# Altium schematic sheet Core Controller V4.0.SchDoc
size 406 x 381 mm
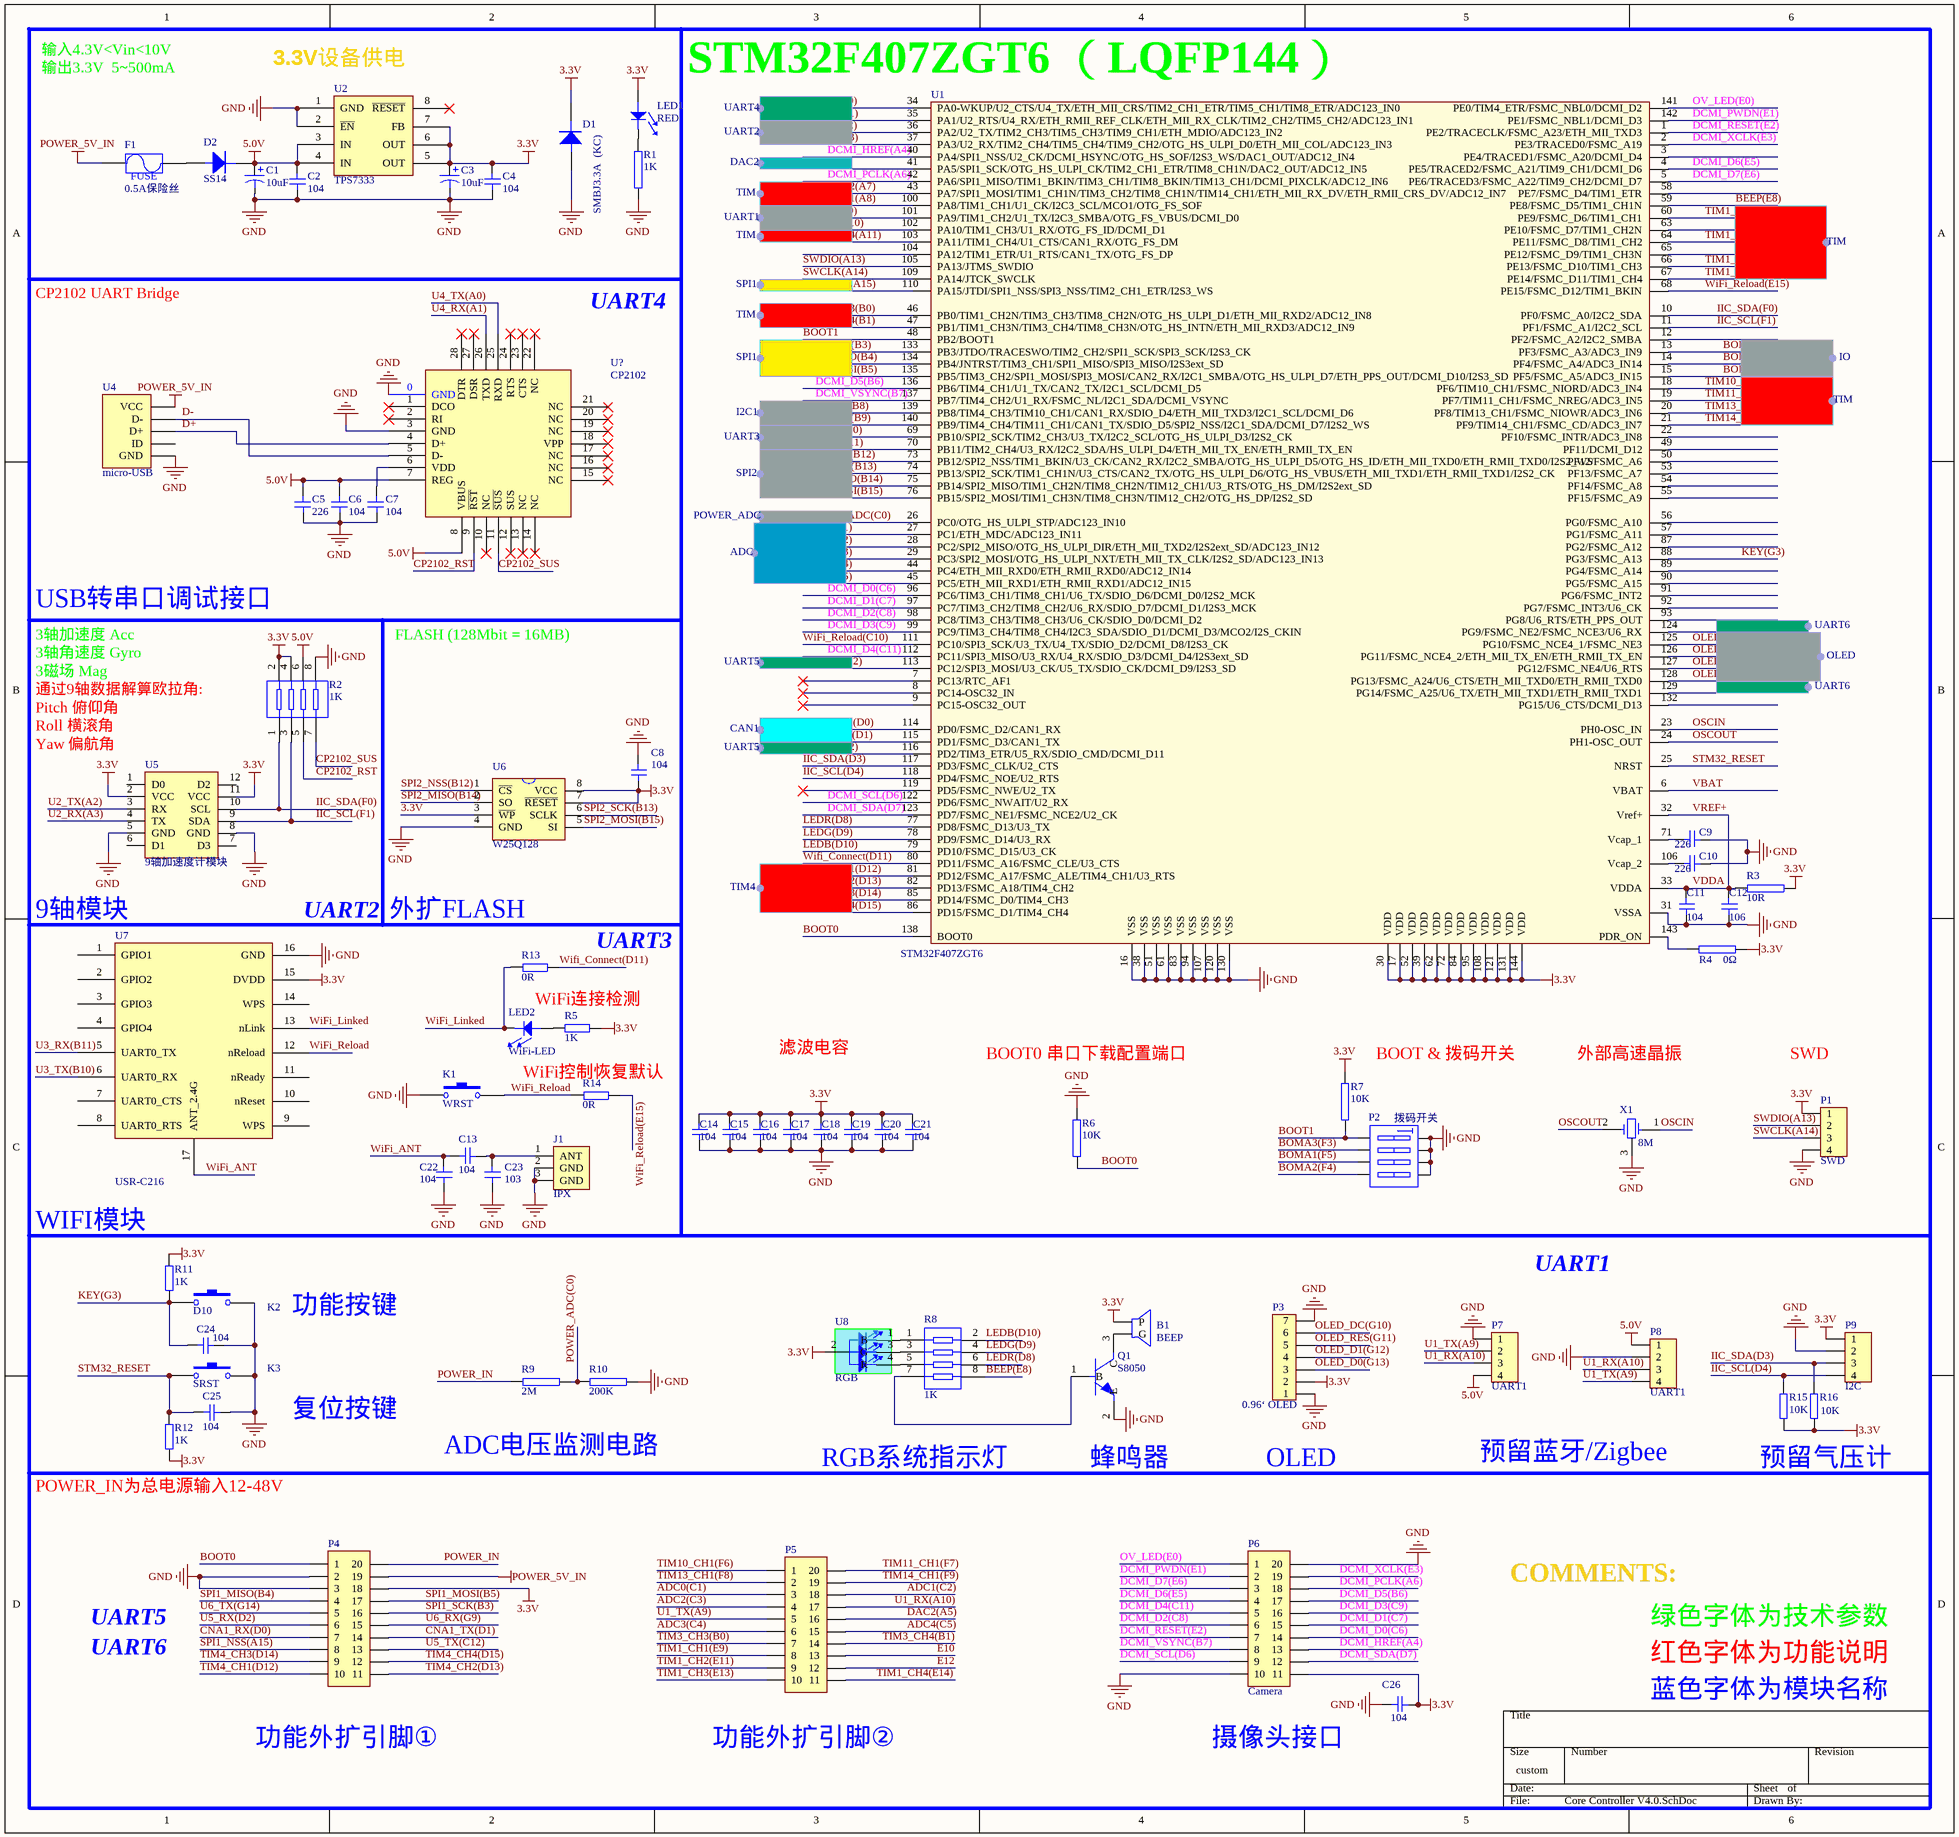
[diagram p0: Core Controller V4.0.SchDoc]

## Parts
B1  BEEP  [BUZZER]
C1  10uF  [TAJ-A]
C2  104  [0805C]
C3  10uF  [TAJ-A]
C4  104  [0805C]
C5  226  [0805C]
C6  104  [0805C]
C7  104  [0805C]
C8  104  [0805C]
C9  226  [0805C]
C10  226  [0805C]
C11  104  [0805C]
C12  106  [0805C]
C13  104  [0805C]
C14  104  [0805C]
C15  104  [0805C]
C16  104  [0805C]
C17  104  [0805C]
C18  104  [0805C]
C19  104  [0805C]
C20  104  [0805C]
C21  104  [0805C]
C22  104  [0805C]
C23  103  [0805C]
C24  104  [0805C]
C25  104  [0805C]
C26  104  [0805C]
D1  SMBJ3.3A  (KC)  [SMBJ]
D2  SS14  [SMA/DO-214AC]
F1  0.5A保险丝  [1206R]
J1  IPX  [IPX天线底座]
K1  WRST  [贴片按键]
K2  D10  [贴片按键]
K3  SRST  [贴片按键]
LED1  RED  [0805LED(RED)]
LED2  WiFi-LED  [0805LED(GREEN)]
P1  SWD  [Header 4]
P2  拨码开关  [拨码开关(4位贴片)]
P3  0.96‘ OLED  [Header 7]
P4  (no value)  [Header 10X2]
P5  (no value)  [Header 10X2]
P6  Camera  [Header 10X2]
P7  UART1  [Header 4(排母)]
P8  UART1  [Header 4(排母)]
P9  I2C  [Header 4(排母)]
Q1  S8050  [SOT-23]
R1  1K  [0805R]
R2  1K  [排阻(4位贴片)]
R3  10R  [0805R]
R4  0Ω  [0805R]
R5  1K  [0805R]
R6  10K  [0805R]
R7  10K  [0805R]
R8  1K  [排阻(4位贴片)]
R9  2M  [0805R]
R10  200K  [0805R]
R11  1K  [0805R]
R12  1K  [0805R]
R13  0R  [0805R]
R14  0R  [0805R]
R15  10K  [0805R]
R16  10K  [0805R]
U1  STM32F407ZGT6  [LQFP-144]
U2  TPS7333  [SOP-8]
U4  micro-USB  [Micro-USB (兼容牛角)]
U5  9轴加速度计模块  [9轴加速度计]
U6  W25Q128  [SOW-8]
U7  USR-C216  [USR-C216]
U8  RGB  [RGB-3528]
U?  CP2102  [QFN-28]
X1  8M  [三脚贴片8M晶振]

## Harnesses
SPI1: 
SPI2: 
ADC: 
UART4: 
UART2: 
UART3: 
CAN1: 
TIM: 
TIM4: 
DAC2: 
UART5: 
UART1: 
POWER_ADC: 
I2C1: 
UART6: 
OLED: 
IO: 

## Nets
3.3V: B1.1(P) C3.1 C4.2 C8.1 C14.2 C15.2 C16.2 C17.2 C18.2 C19.2 C20.2 C21.2 C26.1 D1.2 LED1.1 P1.1 P3.2 P4.18 P6.11 P9.1 R2.2 R2.4 R3.2 R4.2 R5.1 R7.2 R11.2 R12.1 R15.1 R16.1 U1.17(VDD) U1.30(VDD) U1.39(VDD) U1.52(VDD) U1.62(VDD) U1.72(VDD) U1.84(VDD) U1.95(VDD) U1.108(VDD) U1.121(VDD) U1.131(VDD) U1.144(VDD) U2.5(OUT) U2.6(OUT) U2.7(FB) U5.2(VCC) U5.11(VCC) U6.3(~{WP}) U6.7(~{RESET}) U6.8(VCC) U7.15(DVDD) U8.2
5.0V: C1.1 C2.2 C5.1 C6.1 D2.2 P7.4 P8.1 R2.6 U2.3(IN) U2.4(IN) U?.7(REG) U?.8(VBUS)
GND: C1.2 C2.1 C3.2 C4.1 C5.2 C6.2 C7.2 C8.2 C9.1 C10.1 C11.1 C12.1 C14.1 C15.1 C16.1 C17.1 C18.1 C19.1 C20.1 C21.1 C22.1 C23.1 C24.2 C25.2 C26.2 D1.1 J1.2(GND) J1.3(GND) K1.1 K2.2 K3.2 P1.4 P2.5(B4) P2.6(B3) P2.7(B2) P2.8(B1) P3.1 P3.7 P4.2 P4.3 P6.10 P6.20 P7.1 P8.2 P9.2 Q1.2(E) R1.1 R2.8 R6.2 R10.2 U1.16(VSS) U1.31(VSSA) U1.38(VSS) U1.51(VSS) U1.61(VSS) U1.83(VSS) U1.94(VSS) U1.107(VSS) U1.120(VSS) U1.130(VSS) U2.1(GND) U2.2(~{EN}) U4.5(GND) U5.5(GND) U5.8(GND) U6.4(GND) U7.16(GND) U?.0(GND) U?.3(GND) X1.3
POWER_5V_IN: F1.1 P4.19 U4.1(VCC)
ADC0(C1): P5.3 U1.27(PC1/ETH_MDC/ADC123_IN11)
ADC1(C2): P5.18 U1.28(PC2/SPI2_MISO/OTG_HS_ULPI_DIR/ETH_MII_TXD2/I2S2ext_SD/ADC123_IN12)
ADC2(C3): P5.4 U1.29(PC3/SPI2_MOSI/OTG_HS_ULPI_NXT/ETH_MII_TX_CLK/I2S2_SD/ADC123_IN13)
ADC3(C4): P5.6 U1.44(PC4/ETH_MII_RXD0/ETH_RMII_RXD0/ADC12_IN14)
ADC4(C5): P5.15 U1.45(PC5/ETH_MII_RXD1/ETH_RMII_RXD1/ADC12_IN15)
BEEP(E8): R8.8 U1.59(PE8/FSMC_D5/TIM1_CH1N)
BOMA1(F5): P2.3(A3) U1.15(PF5/FSMC_A5/ADC3_IN15)
BOMA2(F4): P2.4(A4) U1.14(PF4/FSMC_A4/ADC3_IN14)
BOMA3(F3): P2.2(A2) U1.13(PF3/FSMC_A3/ADC3_IN9)
BOOT0: P4.1 R6.1 U1.138(BOOT0)
BOOT1: P2.1(A1) R7.1 U1.48(PB2/BOOT1)
CNA1_RX(D0): P4.7 U1.114(PD0/FSMC_D2/CAN1_RX)
CNA1_TX(D1): P4.14 U1.115(PD1/FSMC_D3/CAN1_TX)
CP2102_RST: R2.5 U?.9(~{RST})
CP2102_SUS: R2.7 U?.11(~{SUS})
D+: U4.3(D+) U?.4(D+)
D-: U4.2(D-) U?.5(D-)
DAC2(A5): P5.16 U1.41(PA5/SPI1_SCK/OTG_HS_ULPI_CK/TIM2_CH1_ETR/TIM8_CH1N/DAC2_OUT/ADC12_IN5)
DCMI_D0(C6): P6.14 U1.96(PC6/TIM3_CH1/TIM8_CH1/U6_TX/SDIO_D6/DCMI_D0/I2S2_MCK)
DCMI_D1(C7): P6.15 U1.97(PC7/TIM3_CH2/TIM8_CH2/U6_RX/SDIO_D7/DCMI_D1/I2S3_MCK)
DCMI_D2(C8): P6.6 U1.98(PC8/TIM3_CH3/TIM8_CH3/U6_CK/SDIO_D0/DCMI_D2)
DCMI_D3(C9): P6.16 U1.99(PC9/TIM3_CH4/TIM8_CH4/I2C3_SDA/SDIO_D1/DCMI_D3/MCO2/I2S_CKIN)
DCMI_D4(C11): P6.5 U1.112(PC11/SPI3_MISO/U3_RX/U4_RX/SDIO_D3/DCMI_D4/I2S3ext_SD)
DCMI_D5(B6): P6.17 U1.136(PB6/TIM4_CH1/U1_TX/CAN2_TX/I2C1_SCL/DCMI_D5)
DCMI_D6(E5): P6.4 U1.4(PE5/TRACED2/FSMC_A21/TIM9_CH1/DCMI_D6)
DCMI_D7(E6): P6.3 U1.5(PE6/TRACED3/FSMC_A22/TIM9_CH2/DCMI_D7)
DCMI_HREF(A4): P6.13 U1.40(PA4/SPI1_NSS/U2_CK/DCMI_HSYNC/OTG_HS_SOF/I2S3_WS/DAC1_OUT/ADC12_IN4)
DCMI_PCLK(A6): P6.18 U1.42(PA6/SPI1_MISO/TIM1_BKIN/TIM3_CH1/TIM8_BKIN/TIM13_CH1/DCMI_PIXCLK/ADC12_IN6)
DCMI_PWDN(E1): P6.2 U1.142(PE1/FSMC_NBL1/DCMI_D3)
DCMI_RESET(E2): P6.7 U1.1(PE2/TRACECLK/FSMC_A23/ETH_MII_TXD3)
DCMI_SCL(D6): P6.9 U1.122(PD6/FSMC_NWAIT/U2_RX)
DCMI_SDA(D7): P6.12 U1.123(PD7/FSMC_NE1/FSMC_NCE2/U2_CK)
DCMI_VSYNC(B7): P6.8 U1.137(PB7/TIM4_CH2/U1_RX/FSMC_NL/I2C1_SDA/DCMI_VSYNC)
DCMI_XCLK(E3): P6.19 U1.2(PE3/TRACED0/FSMC_A19)
E10: P5.13 U1.63(PE10/FSMC_D7/TIM1_CH2N)
E12: P5.12 U1.65(PE12/FSMC_D9/TIM1_CH3N)
IIC1_SCL(B8): U1.139(PB8/TIM4_CH3/TIM10_CH1/CAN1_RX/SDIO_D4/ETH_MII_TXD3/I2C1_SCL/DCMI_D6)
IIC1_SDA(B9): U1.140(PB9/TIM4_CH4/TIM11_CH1/CAN1_TX/SDIO_D5/SPI2_NSS/I2C1_SDA/DCMI_D7/I2S2_WS)
IIC_SCL(D4): P9.4 R15.2 U1.118(PD4/FSMC_NOE/U2_RTS)
IIC_SCL(F1): R2.3 U1.11(PF1/FSMC_A1/I2C2_SCL) U5.9(SDA)
IIC_SDA(D3): P9.3 R16.2 U1.117(PD3/FSMC_CLK/U2_CTS)
IIC_SDA(F0): R2.1 U1.10(PF0/FSMC_A0/I2C2_SDA) U5.10(SCL)
KEY(G3): C24.1 K2.1 R11.1 U1.88(PG3/FSMC_A13)
LEDB(D10): R8.2 U1.79(PD10/FSMC_D15/U3_CK)
LEDG(D9): R8.4 U1.78(PD9/FSMC_D14/U3_RX)
LEDR(D8): R8.6 U1.77(PD8/FSMC_D13/U3_TX)
OLED_D0(G13): P3.3 U1.128(PG13/FSMC_A24/U6_CTS/ETH_MII_TXD0/ETH_RMII_TXD0)
OLED_D1(G12): P3.4 U1.127(PG12/FSMC_NE4/U6_RTS)
OLED_DC(G10): P3.6 U1.125(PG10/FSMC_NCE4_1/FSMC_NE3)
OLED_RES(G11): P3.5 U1.126(PG11/FSMC_NCE4_2/ETH_MII_TX_EN/ETH_RMII_TX_EN)
OSCIN: U1.23(PH0-OSC_IN) X1.1
OSCOUT: U1.24(PH1-OSC_OUT) X1.2
OV_LED(E0): P6.1 U1.141(PE0/TIM4_ETR/FSMC_NBL0/DCMI_D2)
POWER_ADC(C0): R9.2 R10.1 U1.26(PC0/OTG_HS_ULPI_STP/ADC123_IN10)
POWER_IN: P4.20 R9.1
SPI1_MISO(B4): P4.4 U1.134(PB4/JNTRST/TIM3_CH1/SPI1_MISO/SPI3_MISO/I2S3ext_SD)
SPI1_MOSI(B5): P4.17 U1.135(PB5/TIM3_CH2/SPI1_MOSI/SPI3_MOSI/CAN2_RX/I2C1_SMBA/OTG_HS_ULPI_D7/ETH_PPS_OUT/DCMI_D10/I2S3_SD)
SPI1_NSS(A15): P4.8 U1.110(PA15/JTDI/SPI1_NSS/SPI3_NSS/TIM2_CH1_ETR/I2S3_WS)
SPI1_SCK(B3): P4.16 U1.133(PB3/JTDO/TRACESWO/TIM2_CH2/SPI1_SCK/SPI3_SCK/I2S3_CK)
SPI2_MISO(B14): U1.75(PB14/SPI2_MISO/TIM1_CH2N/TIM8_CH2N/TIM12_CH1/U3_RTS/OTG_HS_DM/I2S2ext_SD) U6.2(SO)
SPI2_MOSI(B15): U1.76(PB15/SPI2_MOSI/TIM1_CH3N/TIM8_CH3N/TIM12_CH2/OTG_HS_DP/I2S2_SD) U6.5(SI)
SPI2_NSS(B12): U1.73(PB12/SPI2_NSS/TIM1_BKIN/U3_CK/CAN2_RX/I2C2_SMBA/OTG_HS_ULPI_D5/OTG_HS_ID/ETH_MII_TXD0/ETH_RMII_TXD0/I2S2_WS) U6.1(~{CS})
SPI2_SCK(B13): U1.74(PB13/SPI2_SCK/TIM1_CH1N/U3_CTS/CAN2_TX/OTG_HS_ULPI_D6/OTG_HS_VBUS/ETH_MII_TXD1/ETH_RMII_TXD1/I2S2_CK) U6.6(SCLK)
STM32_RESET: C25.1 K3.1 R12.2 U1.25(NRST)
SWCLK(A14): P1.3 U1.109(PA14/JTCK_SWCLK)
SWDIO(A13): P1.2 U1.105(PA13/JTMS_SWDIO)
TIM1_CH1(A8): U1.100(PA8/TIM1_CH1/U1_CK/I2C3_SCL/MCO1/OTG_FS_SOF)
TIM1_CH1(E9): P5.8 U1.60(PE9/FSMC_D6/TIM1_CH1)
TIM1_CH2(E11): P5.9 U1.64(PE11/FSMC_D8/TIM1_CH2)
TIM1_CH3(E13): P5.10 U1.66(PE13/FSMC_D10/TIM1_CH3)
TIM1_CH4(A11): U1.103(PA11/TIM1_CH4/U1_CTS/CAN1_RX/OTG_FS_DM)
TIM1_CH4(E14): P5.11 U1.67(PE14/FSMC_D11/TIM1_CH4)
TIM3_CH2(A7): U1.43(PA7/SPI1_MOSI/TIM1_CH1N/TIM3_CH2/TIM8_CH1N/TIM14_CH1/ETH_MII_RX_DV/ETH_RMII_CRS_DV/ADC12_IN7)
TIM3_CH3(B0): P5.7 U1.46(PB0/TIM1_CH2N/TIM3_CH3/TIM8_CH2N/OTG_HS_ULPI_D1/ETH_MII_RXD2/ADC12_IN8)
TIM3_CH4(B1): P5.14 U1.47(PB1/TIM1_CH3N/TIM3_CH4/TIM8_CH3N/OTG_HS_INTN/ETH_MII_RXD3/ADC12_IN9)
TIM4_CH1(D12): P4.10 U1.81(PD12/FSMC_A17/FSMC_ALE/TIM4_CH1/U3_RTS)
TIM4_CH2(D13): P4.11 U1.82(PD13/FSMC_A18/TIM4_CH2)
TIM4_CH3(D14): P4.9 U1.85(PD14/FSMC_D0/TIM4_CH3)
TIM4_CH4(D15): P4.12 U1.86(PD15/FSMC_D1/TIM4_CH4)
TIM10_CH1(F6): P5.1 U1.18(PF6/TIM10_CH1/FSMC_NIORD/ADC3_IN4)
TIM11_CH1(F7): P5.20 U1.19(PF7/TIM11_CH1/FSMC_NREG/ADC3_IN5)
TIM13_CH1(F8): P5.2 U1.20(PF8/TIM13_CH1/FSMC_NIOWR/ADC3_IN6)
TIM14_CH1(F9): P5.19 U1.21(PF9/TIM14_CH1/FSMC_CD/ADC3_IN7)
U1_RX(A10): P5.17 P7.3 P8.3 U1.102(PA10/TIM1_CH3/U1_RX/OTG_FS_ID/DCMI_D1)
U1_TX(A9): P5.5 P7.2 P8.4 U1.101(PA9/TIM1_CH2/U1_TX/I2C3_SMBA/OTG_FS_VBUS/DCMI_D0)
U2_RX(A3): U1.37(PA3/U2_RX/TIM2_CH4/TIM5_CH4/TIM9_CH2/OTG_HS_ULPI_D0/ETH_MII_COL/ADC123_IN3) U5.4(TX)
U2_TX(A2): U1.36(PA2/U2_TX/TIM2_CH3/TIM5_CH3/TIM9_CH1/ETH_MDIO/ADC123_IN2) U5.3(RX)
U3_RX(B11): U1.70(PB11/TIM2_CH4/U3_RX/I2C2_SDA/HS_ULPI_D4/ETH_MII_TX_EN/ETH_RMII_TX_EN) U7.5(UART0_TX)
U3_TX(B10): U1.69(PB10/SPI2_SCK/TIM2_CH3/U3_TX/I2C2_SCL/OTG_HS_ULPI_D3/I2S2_CK) U7.6(UART0_RX)
U4_RX(A1): U1.35(PA1/U2_RTS/U4_RX/ETH_RMII_REF_CLK/ETH_MII_RX_CLK/TIM2_CH2/TIM5_CH2/ADC123_IN1) U?.26(TXD)
U4_TX(A0): U1.34(PA0-WKUP/U2_CTS/U4_TX/ETH_MII_CRS/TIM2_CH1_ETR/TIM5_CH1/TIM8_ETR/ADC123_IN0) U?.25(RXD)
U5_RX(D2): P4.6 U1.116(PD2/TIM3_ETR/U5_RX/SDIO_CMD/DCMI_D11)
U5_TX(C12): P4.13 U1.113(PC12/SPI3_MOSI/U3_CK/U5_TX/SDIO_CK/DCMI_D9/I2S3_SD)
U6_RX(G9): P4.15 U1.124(PG9/FSMC_NE2/FSMC_NCE3/U6_RX)
U6_TX(G14): P4.5 U1.129(PG14/FSMC_A25/U6_TX/ETH_MII_TXD1/ETH_RMII_TXD1)
VBAT: U1.6(VBAT)
VDDA: C11.2 C12.2 R3.1 U1.32(Vref+) U1.33(VDDA)  [also labelled VREF+]
WiFi_ANT: C13.2 C22.2 U7.17(ANT_2.4G)
Wifi_Connect(D11): R13.2 U1.80(PD11/FSMC_A16/FSMC_CLE/U3_CTS)
WiFi_Linked: LED2.2 R13.1 U7.13(nLink)
WiFi_Reload: K1.2 R14.1 U7.12(nReload)
WiFi_Reload(C10): U1.111(PC10/SPI3_SCK/U3_TX/U4_TX/SDIO_D2/DCMI_D8/I2S3_CK)
WiFi_Reload(E15): R14.2 U1.68(PE15/FSMC_D12/TIM1_BKIN)
NetB1_2: B1.2(G) Q1.3(C)
NetC7_1: C7.1 U?.6(VDD)
NetC9_2: C9.2 U1.71(Vcap_1)
NetC10_2: C10.2 U1.106(Vcap_2)
NetC13_1: C13.1 C23.2 J1.1(ANT)
NetD2_1: D2.1 F1.2
NetLED1_2: LED1.2 R1.2
NetLED2_1: LED2.1 R5.2
NetQ1_1: Q1.1(B) R8.7
NetR4_1: R4.1 U1.143(PDR_ON)
NetR8_1: R8.1 U8.1(B)
NetR8_3: R8.3 U8.3(G)
NetR8_5: R8.5 U8.4(R)

Not connected (* = marked no-connect by the designer): U1 3(PE4/TRACED1/FSMC_A20/DCMI_D4) 7(PC13/RTC_AF1)* 8(PC14-OSC32_IN)* 9(PC15-OSC32_OUT)* 12(PF2/FSMC_A2/I2C2_SMBA) 22(PF10/FSMC_INTR/ADC3_IN8) 49(PF11/DCMI_D12) 50(PF12/FSMC_A6) 53(PF13/FSMC_A7) 54(PF14/FSMC_A8) 55(PF15/FSMC_A9) 56(PG0/FSMC_A10) 57(PG1/FSMC_A11) 58(PE7/FSMC_D4/TIM1_ETR) 87(PG2/FSMC_A12) 89(PG4/FSMC_A14) 90(PG5/FSMC_A15) 91(PG6/FSMC_INT2) 92(PG7/FSMC_INT3/U6_CK) 93(PG8/U6_RTS/ETH_PPS_OUT) 104(PA12/TIM1_ETR/U1_RTS/CAN1_TX/OTG_FS_DP) 119(PD5/FSMC_NWE/U2_TX)* 132(PG15/U6_CTS/DCMI_D13); U2 8(~{RESET})*; U4 4(ID); U5 1(D0) 6(D1) 7(D3) 12(D2); U7 1(GPIO1) 2(GPIO2) 3(GPIO3) 4(GPIO4) 7(UART0_CTS) 8(UART0_RTS) 9(WPS) 10(nReset) 11(nReady) 14(WPS); U? 1(DCO)* 2(RI)* 10(NC)* 12(SUS)* 13(NC)* 14(NC)* 15(NC)* 16(NC)* 17(NC)* 18(VPP)* 19(NC)* 20(NC)* 21(NC)* 22(NC)* 23(CTS)* 24(RTS)* 27(DSR)* 28(DTR)*

## Notes on the sheet
- 输入4.3V<Vin<10V
- 输出3.3V  5~500mA
- (near U2) 3.3V设备供电
- (near U1) STM32F407ZGT6 （LQFP144）
- CP2102 UART Bridge
- UART4
- USB转串口调试接口
- 3轴加速度 Acc
- FLASH (128Mbit = 16MB)
- 3轴角速度 Gyro
- 3磁场 Mag
- 通过9轴数据解算欧拉角:
- Pitch 俯仰角
- Yaw 偏航角
- Roll 横滚角
- (near U7) 9轴模块
- (near U7) UART2
- 外扩FLASH
- WiFi连接检测
- UART3
- 滤波电容
- BOOT0 串口下载配置端口
- (near R7) BOOT & 拨码开关
- 外部高速晶振
- SWD
- (near R14) WiFi控制恢复默认
- WIFI模块
- UART1
- 功能按键
- 复位按键
- (near R12) POWER_IN为总电源输入12-48V
- ADC电压监测电路
- RGB系统指示灯
- (near Q1) 蜂鸣器
- OLED
- 预留蓝牙/Zigbee
- 预留气压计
- COMMENTS:
- UART5
- UART6
- 绿色字体为技术参数
- 红色字体为功能说明
- 蓝色字体为模块名称
- 功能外扩引脚①
- (near P5) 功能外扩引脚②
- 摄像头接口
- (in symbol Fuse) FUSE

## Library data of the parts
C1 C3 = Pol Cap: 极性贴片电容
C2 C4-C8 C13 C22 C23 C26 = Cap1: 无极贴片电容
C9-C12 C14-C21 C24 C25 = C1
D1 D2 = Diode: 二极管
F1 = Fuse: 保险丝
J1 = IPX天线座
K1 = 轻触按键: 轻触开关
K2 K3 = Key(两脚贴片)
LED1 LED2 = LED: 发光二极管
P1 P7-P9 = Header 4: 排针
P2 = 拨码开关4: 4位拨码开关
P3 = Header 7: 排针
P4-P6 = Header 10X2
Q1 = NPN: NPN三极管
R1 R3 R4 R6 R7 R9 R10 = R1
R2 R8 = Res-4: 排阻
R5 R11-R16 = Res: 电阻
U1 = STM32F407ZET6
U2 = TPS7333: 3.3V电源芯片
U4 = micro-USB: USB接口
U5 = 9轴加速度计
U6 = W25Q128: FLASH芯片
U? = CP2102: USB转串口芯片
X1 = XTAL三脚贴片晶振